# Altium schematic sheet AutoRange.SchDoc
size A4; SheetNumber: 10; SheetTotal: 10
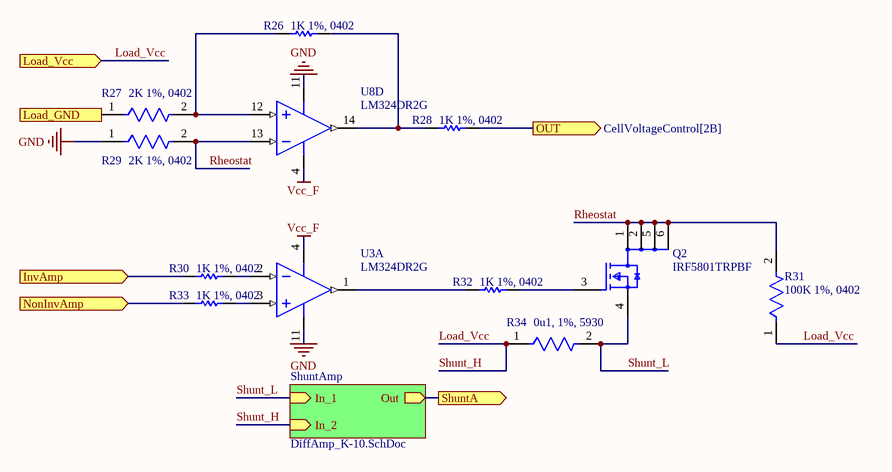
[diagram p0: AutoRange.SchDoc]

## Parts
Q2  IRF5801TRPBF  [FP-PG-TSOP-6-MFG]
R26  1K 1%, 0402  [RESC1005X40X25NL05T05]
R27  2K 1%, 0402  [FP-ERJ2RK-MFG]
R28  1K 1%, 0402  [RESC1005X40X25NL05T05]
R29  2K 1%, 0402  [FP-ERJ2RK-MFG]
R30  1K 1%, 0402  [RESC1005X40X25NL05T05]
R31  100K 1%, 0402  [FP-ERJ2RK-IPC_C]
R32  1K 1%, 0402  [RESC1005X40X25NL05T05]
R33  1K 1%, 0402  [RESC1005X40X25NL05T05]
R34  0u1, 1%, 5930  [FP-CSS2H-5930K-1L00F-MFG]
U3  LM324DR2G  [ONSC-SOIC-14-751A-03_V]  (part A of 4)
U8  LM324DR2G  [ONSC-SOIC-14-751A-03_V]  (part D of 4)

## Sub-sheets
ShuntAmp = DiffAmp_K-10.SchDoc: Out (out), In_2 (in), In_1 (in)

## Ports
InvAmp (in, see PowerModule[3A]), Load_GND (in, see PowerModule[3A]), Load_Vcc (in, see PowerModule[3A]), NonInvAmp (in, see PowerModule[3A]), OUT (out, see CellVoltageControl[2B]), ShuntA (out, see PowerModule[3A])

## Nets
GND: R29.1 U3.11(VEE/GND) U8.11(VEE/GND)
Vcc_F: U3.4(VCC) U8.4(VCC)
InvAmp: R30.1 ; port InvAmp
Load_GND: R27.1 ; port Load_GND
Load_Vcc: R31.1 R34.1 ; port Load_Vcc, sheet ShuntAmp/In_2  [also labelled Shunt_H]
NonInvAmp: R33.1 ; port NonInvAmp
OUT: R28.2 ; port OUT
Rheostat: Q2.1(D) Q2.2(D) Q2.5(D) Q2.6(D) R29.2 R31.2 U8.13(IN4-)
Shunt_L: Q2.4(S) R34.2 ; sheet ShuntAmp/In_1
ShuntA: port ShuntA, sheet ShuntAmp/Out
NetQ2_3: Q2.3(G) R32.2
NetR26_1: R26.1 R27.2 U8.12(IN4+)
NetR26_2: R26.2 R28.1 U8.14(OUT4)
NetR30_2: R30.2 U3.2(IN1-)
NetR32_1: R32.1 U3.1(OUT1)
NetR33_2: R33.2 U3.3(IN1+)

## Library data of the parts
Q2 = CMP-32901-001111-1: MOSFET N-CH 200V 600MA MICRO6; Turn-On Delay Time: 6.5ns; Power Dissipation: 2W; Rds On Max: 2.2R; Polarization: N; Input Capacitance: 88pF; Turn-Off Delay Time: 8.8ns; Threshold Voltage: 5.5V; Gate to Source Voltage (Vgs): 30V; Max Dual Supply Voltage: 200V; Mount: Surface Mount; Width: 0.067inch; RoHS Compliant: Yes; Series: HEXFET®; Packaging: Cut Tape; Drain to Source Breakdown Voltage: 200V; Length: 0.118inch; Height: 0.039inch; Number of Pins: 6; Case/Package: TSOP; Halogen Free: Halogen Free; Drain to Source Voltage (Vdss): 200V; Min Operating Temperature: -55°C; Reach SVHC Compliant: Yes; Max Operating Temperature: 150°C; Lead Free: Lead Free; Max Power Dissipation: 2W; Continuous Drain Current (ID): 600mA; Drain to Source Resistance: 2.2R
R26 R28 R30 R32 R33 = CMP-1011-00510-4: Chip Resistor, 1 KOhm, +/- 1%, 100 mW, -55 to 155 degC, 0402 (1005 Metric), RoHS, Tape and Reel; PartNumber: ERJ-2RKF1001X; Manufacturer: Basic Passives; Voltage Rating: 50 V; Case\/Package: 0402; Resistance: 1 KOhm; Power Rating: 100 mW; DatasheetVersion: 04/2015; Radiation Hardening: No; Pins: 2; Height: 0.35 mm; RoHSCompliant: true; Case Code (Imperial): 0402; ComponentLink2Description: Datasheet; ComponentLink1Description: Manufacturer URL; PackageReference: 0402; Mount: Surface Mount; Package Quantity: 10000; Tolerance: 1%; ComponentLink1URL: http://www.panasonic.com/; PackageDescription: 2-Pin Surface Mount Device, Body 1 x 0.5 mm; Mounting Technology: Surface Mount; Case Code (Metric): 1005; ComponentLink2URL: http://industrial.panasonic.com/cdbs/www-data/pdf/RDA0000/AOA0000C86.pdf; REACH SVHC: Yes; Packaging: Tape and Reel; Max Operating Temperature: 155 degC; Min Operating Temperature: -55 degC; Width: 0.5 mm; Length: 1 mm
R27 R29 = CMP-2002-00758-4: RES SMD 2K OHM 1% 1/10W 0402; Temperature Coefficient: 100ppm/°C; Max Power Dissipation: 100mW; Working Voltage: 50V; Resistance: 2kR; Number of Terminations: 2; Technology: THICK FILM; Packaging: Tape and Reel; RoHS Compliant: Yes; Min Operating Temperature: -55°C; Length: 1mm; Construction: Rectangular; Features: Automotive AEC-Q200; Contact Plating: Tin; Lead Free: Lead Free; Series: ERJ; Power Rating: 100mW; REACH SVHC: No SVHC; Resistor Type: Thick Film; Max Operating Temperature: 155°C; Package Quantity: 10000; Height: 0.35mm; Case/Package: 0402; Tolerance: 1%; Mount: Surface Mount; Termination: SMD/SMT; Resistance Tolerance: 1%; Depth: 0.5mm; Voltage Rating (DC): 50V; Voltage Rating: 50V; Case Code (Imperial): 0402; Military Standard: Not; Width: 0.02inch; Radiation Hardening: No; Case Code (Metric): 1005
R31 = CMP-2002-00608-4: RES SMD 100K OHM 1% 1/10W 0402; Resistance: 100kR; Voltage Rating (DC): 50V; Power Rating: 100mW; Temperature Coefficient: 100ppm/°C; Case/Package: 0402; Length: 1mm; Package Quantity: 1; Radiation Hardening: No; Case Code (Metric): 1005; Contact Plating: Tin; Mount: Surface Mount; Depth: 0.5mm; Max Operating Temperature: 155°C; Lead Free: Lead Free; Width: 0.5mm; Composition: Thick Film; Case Code (Imperial): 0402; Tolerance: 1%; Termination: SMD/SMT; Number of Pins: 2; Height: 0.35mm; Voltage Rating: 50V; Military Standard: Not; REACH SVHC: No SVHC; Packaging: Tape and Reel; Min Operating Temperature: -55°C; Max Power Dissipation: 100mW; Features: Automotive AEC-Q200; Number of Terminations: 2
R34 = CMP-00059-73869598-1: CSS2H-5930K-1L00F Res Metal Strip 5930 0.001 Ohm 1% 9W ±50ppm/C Pad SMD Automotive T/R; Resistance: 1mΩ; Temperature Coefficient: 50ppm/°C; Case Code (Imperial): 5931; Width: 7.747mm; Min Operating Temperature: -55°C; Tolerance: 1%; Max Power Dissipation: 9W; Case Code (Metric): 1577; Max Operating Temperature: 170°C; NexarPartId: 73869598; Power Rating: 9W; Composition: Metal Element; Case/Package: 5930; Height: 939.8µm; Number of Terminations: 2; Schedule B: 8533210045, 8533210045; Packaging: Cut Tape; REACH SVHC: No SVHC; Features: Moisture Resistant; RoHS: Compliant; Length: 15.0114mm
U3 U8 = CMP-1310-00171-1: Single Supply Quad Operational Amplifier, 3 to 32 V, 0 to 70 degC, 14-Pin SOIC, Pb-Free, Tape and Reel; Manufacturer: On Semiconductor; VCC Max (V): 32; VCC Min (V): 3; PackageVersion: Rev. K, 05/2011; ComponentLink3URL: http://www.onsemi.com/pub_link/Collateral/751A-03.PDF; ComponentLink3Description: Package Specification; Packing: Tape and Reel; ComponentLink2URL: http://www.onsemi.cn/pub_link/Collateral/LM324-D.PDF; PackageReference: SOIC-14-751A-03; ComponentLink1URL: http://www.onsemi.com/; PackageDescription: 14-Pin Small Outline Integrated Circuit, Body 8.65 x 3.9 mm, Pitch 1.27 mm; ComponentLink1Description: Manufacturer URL; DatasheetVersion: Rev. 25; Mounting Technology: Surface Mount; RoHS: TRUE; ComponentLink2Description: Datasheet; PartNumber: LM324DR2G